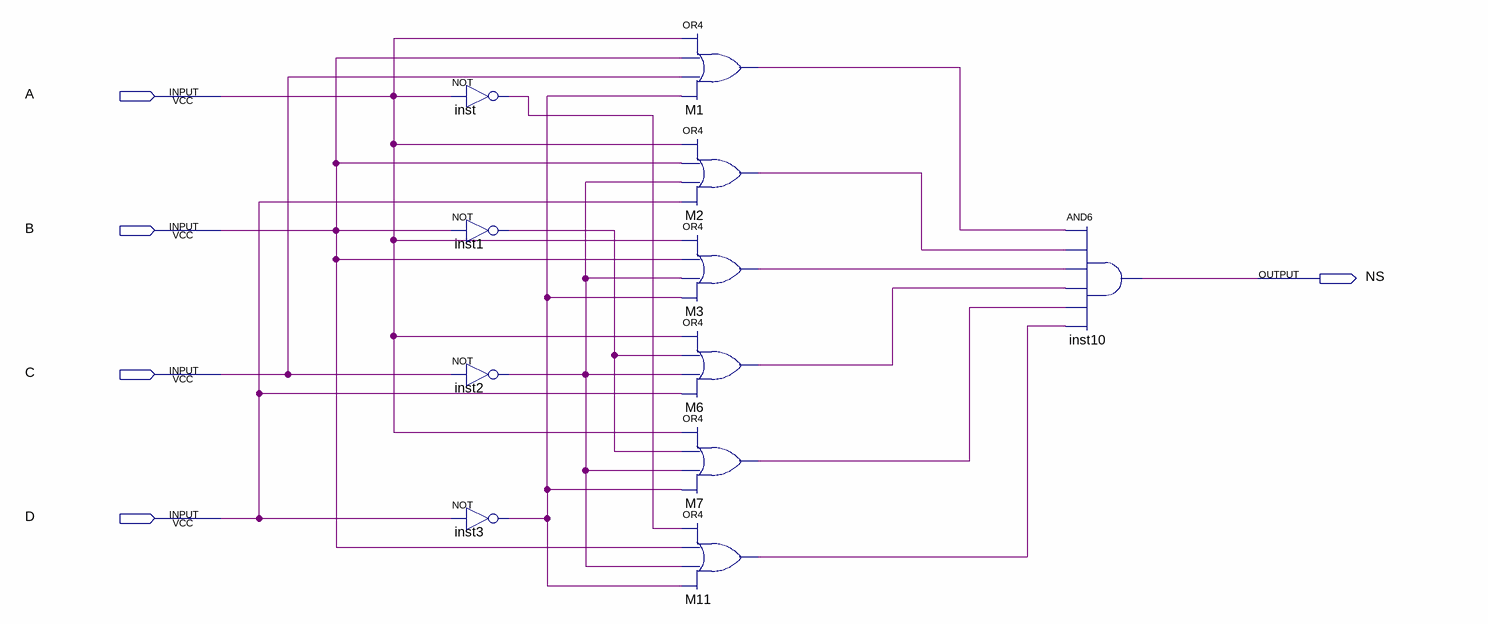
[diagram p0: schematic sheet]
// Quartus schematic NW_POS.bdf as structural Verilog: 11 symbols, 5 pins
module NW_POS (
  input  A,
  input  B,
  input  C,
  input  D,
  output NS
);

  wire inst1_out, inst2_out, inst3_out, inst_out, M1_out, M2_out, M3_out, M6_out, M7_out, M11_out;

  not inst (inst_out, A);
  not inst1 (inst1_out, B);
  not inst2 (inst2_out, C);
  not inst3 (inst3_out, D);
  or M1 (M1_out, A, B, C, inst3_out);
  or M2 (M2_out, A, B, inst2_out, D);
  or M3 (M3_out, A, B, inst2_out, inst3_out);
  or M6 (M6_out, A, inst1_out, inst2_out, D);
  or M7 (M7_out, A, inst1_out, inst2_out, inst3_out);
  or M11 (M11_out, inst_out, B, inst2_out, inst3_out);
  and inst10 (NS, M1_out, M2_out, M3_out, M6_out, M7_out, M11_out);
endmodule
